# Altium project BMS_Carrier_Board.PrjPcb (part 3 of 3)

## Sheet BMS Carrier - Fan Controls.SchDoc: BMS Fan and Relay Control
size B; Author: Kevin Chen, Taiping Li; DocumentNumber: 4; SheetNumber: 4; SheetTotal: 4; Website: www.uwmidsun.com
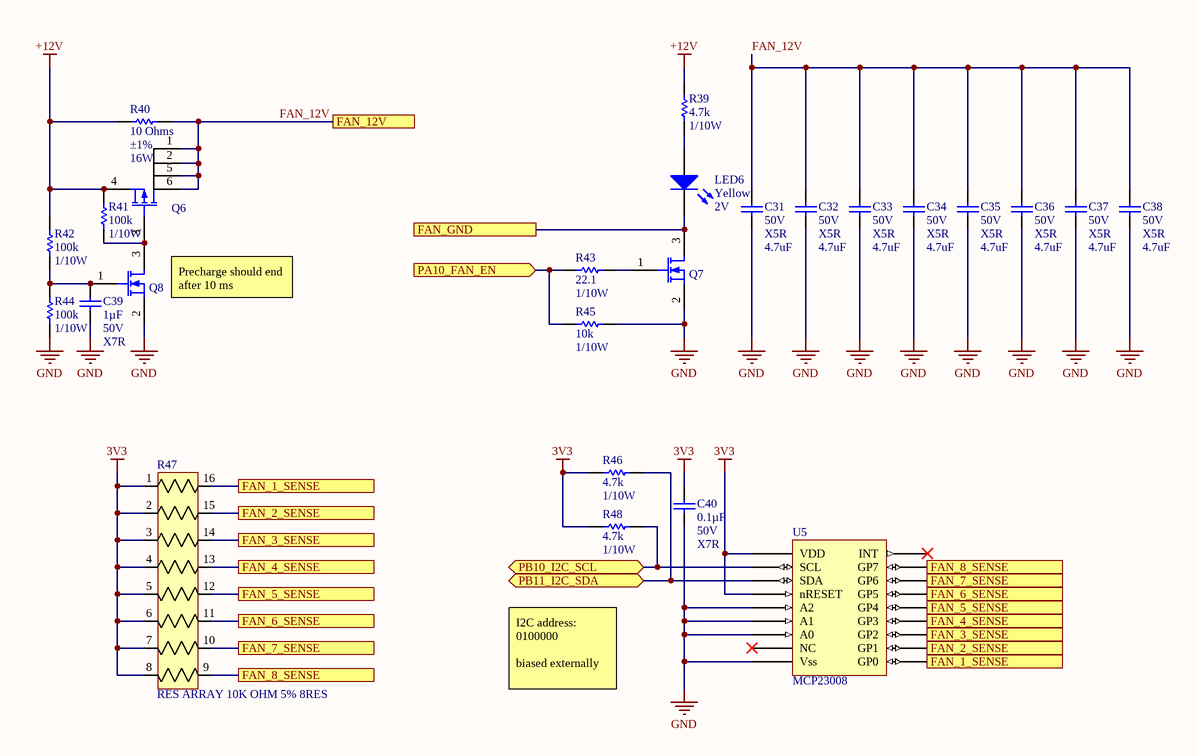
[diagram p6: BMS Carrier - Fan Controls.SchDoc]

### Parts
C31  value 4.7uF  Voltage - Rated: 50V  Temperature Coefficient: X5R  [CAP, 0805]  (hidden comment: CAP CER 4.7UF 50V 10% X5R 0805)
C32  value 4.7uF  Voltage - Rated: 50V  Temperature Coefficient: X5R  [CAP, 0805]  (hidden comment: CAP CER 4.7UF 50V 10% X5R 0805)
C33  value 4.7uF  Voltage - Rated: 50V  Temperature Coefficient: X5R  [CAP, 0805]  (hidden comment: CAP CER 4.7UF 50V 10% X5R 0805)
C34  value 4.7uF  Voltage - Rated: 50V  Temperature Coefficient: X5R  [CAP, 0805]  (hidden comment: CAP CER 4.7UF 50V 10% X5R 0805)
C35  value 4.7uF  Voltage - Rated: 50V  Temperature Coefficient: X5R  [CAP, 0805]  (hidden comment: CAP CER 4.7UF 50V 10% X5R 0805)
C36  value 4.7uF  Voltage - Rated: 50V  Temperature Coefficient: X5R  [CAP, 0805]  (hidden comment: CAP CER 4.7UF 50V 10% X5R 0805)
C37  value 4.7uF  Voltage - Rated: 50V  Temperature Coefficient: X5R  [CAP, 0805]  (hidden comment: CAP CER 4.7UF 50V 10% X5R 0805)
C38  value 4.7uF  Voltage - Rated: 50V  Temperature Coefficient: X5R  [CAP, 0805]  (hidden comment: CAP CER 4.7UF 50V 10% X5R 0805)
C39  Capacitance: 1µF  Voltage: 50V  Temperature Coefficient: X7R  [CAP, 0603]  (hidden comment: CAP CER 1UF 50V 10% X7R 0603)
C40  Capacitance: 0.1µF  Voltage: 50V  Temperature Coefficient: X7R  [CAP, 0603]  (hidden comment: CAP CER 0.1UF 50V 10% X7R 0603)
LED6  Color: Yellow  Voltage - Forward (Vf) (Typ): 2V  [LED_0603]  (hidden comment: LED YELLOW CLEAR 2.1V 0603)
Q6  MOSFET P-CH 30V 4A 1.6W SOT-23-6  [P-MOSFET]  (value not drawn)
Q7  MOSFET N-CH 30V 6.2A 0.9W SOT-23  [MOSFET N-CH 30V 6.2A 0.9W SOT-23]  (value not drawn)
Q8  MOSFET N-CH 30V 6.2A 0.9W SOT-23  [MOSFET N-CH 30V 6.2A 0.9W SOT-23]  (value not drawn)
R39  Resistance (Ohms): 4.7k  Power (Watts): 1/10W  [RES, 0603]  (hidden comment: RES 4.7K OHM 1% 1/10W 0603)
R40  Resistance: 10 Ohms  Tolerance: ±1%  Power: 16W  [RES2512]  (hidden comment: RES 10 OHM 1% 16W 2512)
R41  Resistance: 100k  Power: 1/10W  [RES, 0603]  (hidden comment: RES 100K OHM 5% 1/8W 0603)
R42  Resistance: 100k  Power: 1/10W  [RES, 0603]  (hidden comment: RES 100K OHM 5% 1/8W 0603)
R43  Resistance: 22.1  Power: 1/10W  [RES, 0603]  (hidden comment: RES 22.1 OHM 1% 1/10W 0603)
R44  Resistance: 100k  Power: 1/10W  [RES, 0603]  (hidden comment: RES 100K OHM 5% 1/8W 0603)
R45  Resistance: 10k  Power: 1/10W  [RES, 0603]  (hidden comment: RES 10K OHM 1% 1/10W 0603)
R46  Resistance (Ohms): 4.7k  Power (Watts): 1/10W  [RES, 0603]  (hidden comment: RES 4.7K OHM 1% 1/10W 0603)
R47  RES ARRAY 10K OHM 5% 8RES  [RES ARRAY, 8 POS 1506]
R48  Resistance (Ohms): 4.7k  Power (Watts): 1/10W  [RES, 0603]  (hidden comment: RES 4.7K OHM 1% 1/10W 0603)
U5  MCP23008  [IC 18SOIC]

### Ports
FAN_1_SENSE, FAN_1_SENSE (in), FAN_2_SENSE, FAN_2_SENSE (in), FAN_3_SENSE, FAN_3_SENSE (in), FAN_4_SENSE, FAN_4_SENSE (in), FAN_5_SENSE, FAN_5_SENSE (in), FAN_6_SENSE, FAN_6_SENSE (in), FAN_7_SENSE, FAN_7_SENSE (in), FAN_8_SENSE, FAN_8_SENSE (in), FAN_12V, FAN_GND, PA10_FAN_EN (in), PB10_I2C_SCL (bidir), PB11_I2C_SDA (bidir)

### Nets
3V3: C40.1 R46.1 R47.1 R47.2 R47.3 R47.4 R47.5 R47.6 R47.7 R47.8 R48.1 U5.6(nRESET) U5.18(VDD)
+12V: Q6.4(S) R39.1 R40.1 R41.2 R42.1
GND: C31.2 C32.2 C33.2 C34.2 C35.2 C36.2 C37.2 C38.2 C39.2 C40.2 Q7.2(S) Q8.2(S) R44.2 R45.2 U5.3(A2) U5.4(A1) U5.5(A0) U5.9(Vss)
FAN_12V: C31.1 C32.1 C33.1 C34.1 C35.1 C36.1 C37.1 C38.1 Q6.1(D) Q6.2(D) Q6.5(D) Q6.6(D) R40.2 ; port FAN_12V
PA10_FAN_EN: R43.2 R45.1 ; port PA10_FAN_EN
PB10/USART3_TX/I2C2_SCL: R48.2 U5.1(SCL) ; port PB10_I2C_SCL
PB11/USART3_RX/I2C2_SDA: R46.2 U5.2(SDA) ; port PB11_I2C_SDA
NetC7_1: R47.15 U5.11(GP1) ; port FAN_2_SENSE
NetC8_1: R47.16 U5.10(GP0) ; port FAN_1_SENSE
NetC9_1: R47.11 U5.15(GP5) ; port FAN_6_SENSE
NetC10_1: R47.12 U5.14(GP4) ; port FAN_5_SENSE
NetC14_1: R47.13 U5.13(GP3) ; port FAN_4_SENSE
NetC15_1: R47.14 U5.12(GP2) ; port FAN_3_SENSE
NetC16_1: R47.9 U5.17(GP7) ; port FAN_8_SENSE
NetC17_1: R47.10 U5.16(GP6) ; port FAN_7_SENSE
NetC39_1: C39.1 Q8.1(G) R42.2 R44.1
NetLED6_1: LED6.1(A) R39.2
NetLED6_2: LED6.2(K) Q7.3(D) ; port FAN_GND
NetQ6_3: Q6.3(G) Q8.3(D) R41.1
NetQ7_1: Q7.1(G) R43.1

Not connected (* = marked no-connect by the designer): U5 7(NC)* 8(INT)*

### Notes on the sheet
- Precharge should end after 10 ms
- I2C address: 0100000
  biased externally
- PROJECT
- DOCUMENT
- DRAWN BY
- LAST MODIFIED
- PART NUMBER
- REVISION
- SHEET
- VARIANT
- OF
- Engineering 5 - 1002
  University of Waterloo
  (519) 888-4567 x32978
  hardware@uwmidsun.com

### Library data of the parts
C31-C38 = CAP CER 4.7UF 50V 10% X5R 0805: 4.7µF ±20% 50V Ceramic Capacitor X5R 0805 (2012 Metric); Manufacturer 1: Murata Electronics North America; Manufacturer Part Number 1: GRT21BR61H475ME13L; Description 1: CAP CER 4.7UF 50V X5R 0805; Supplier 1: Digi-Key; Supplier Part Number 1: 490-12395-1-ND; RoHS: RoHS Compliant; Category: Capacitors; Stock 1: 4286; Pricing 1: 1=0.56, 10=0.389, 100=0.2338, 500=0.17536, 1000=0.14808 (CAD); Packaging: Cut Tape (CT); Part Status: Active; Tolerance: ±20%; Operating Temperature: -55°C ~ 85°C; Features: -; Ratings: AEC-Q200; Applications: Automotive; Mounting Type: Surface Mount, MLCC; Package / Case: 0805 (2012 Metric); Size / Dimension: 0.079" L x 0.049" W (2.00mm x 1.25mm); Height - Seated (Max): -; Thickness (Max): 0.057" (1.45mm); Lead Spacing: -; Lead Style: -; ComponentLink1URL: http://search.murata.co.jp/Ceramy/image/img/A01X/G101/ENG/GRT21BR61H475ME13-01.pdf; ComponentLink1Description: http://search.murata.co.jp/Ceramy/image/img/A01X/G101/ENG/GRT21BR61H475ME13-01.pdf
C39 = CAP CER 1UF 50V 10% X7R 0603: 1µF ±10% 50V Ceramic Capacitor X7R 0603 (1608 Metric); Manufacturer 1: Taiyo Yuden; Manufacturer Part Number 1: UMK107AB7105KA-T; Supplier 1: Digi-Key; Supplier Part Number 1: 587-3247-1-ND; Packaging: Cut Tape (CT); Part Status: Active; Operating Temperature: -55°C ~ 125°C; Ratings: -; Mounting Type: Surface Mount, MLCC; Package / Case: 0603 (1608 Metric); Size / Dimension: 0.063" L x 0.031" W (1.60mm x 0.80mm); Height - Seated (Max): -; Thickness (Max): 0.037" (0.95mm); Lead Spacing: -; Lead Style: -; ComponentLink1URL: http://www.yuden.co.jp/productdata/catalog/en/mlcc_all_e.pdf; ComponentLink1Description: http://www.yuden.co.jp/productdata/catalog/en/mlcc_all_e.pdf; Tolerance: ±10%
C40 = CAP CER 0.1UF 50V 10% X7R 0603: 0.10µF ±10% 50V Ceramic Capacitor X7R 0603 (1608 Metric); Manufacturer 1: AVX Corporation; Manufacturer Part Number 1: 06035C104KAT2A; Supplier 1: Digi-Key; Supplier Part Number 1: 478-5052-1-ND; Packaging: Cut Tape (CT); Part Status: Active; Operating Temperature: -55°C ~ 125°C; Ratings: -; Mounting Type: Surface Mount, MLCC; Package / Case: 0603 (1608 Metric); Size / Dimension: 0.063" L x 0.032" W (1.60mm x 0.81mm); Height - Seated (Max): -; Thickness (Max): 0.035" (0.90mm); Lead Spacing: -; Lead Style: -; ComponentLink1URL: http://datasheets.avx.com/X7RDielectric.pdf; ComponentLink1Description: http://datasheets.avx.com/X7RDielectric.pdf; Tolerance: ±10%
LED6 = LED YELLOW CLEAR 2.1V 0603: Yellow 590nm LED Indication - Discrete 2V 0603 (1608 Metric); Manufacturer: Wurth Electronics Inc.; Manufacturer Part Number: 150060YS75000; Lens Color: Colorless; Millicandela Rating: 120mcd; Lens Style/Size: Rectangle with Flat Top, 1.10mm x 0.70mm; Current - Test: 20mA; Viewing Angle: 140°; Wavelength - Peak: 595nm; Supplier 1: Digi-Key; RoHS: RoHS Compliant; Category: Optoelectronics; Stock 1: 10523; Pricing 1: 1=0.21, 100=0.1617, 500=0.13964 (CAD); Packaging: Cut Tape (CT); Part Status: Active; Lens Transparency: Clear; Mounting Type: Surface Mount; Wavelength - Dominant: 590nm; Features: -; Package / Case: 0603 (1608 Metric); Supplier Device Package: 0603; Size / Dimension: 1.60mm L x 0.80mm W; Height (Max): 0.80mm; ComponentLink1URL: http://katalog.we-online.de/led/datasheet/150060YS75000.pdf; ComponentLink1Description: http://katalog.we-online.de/led/datasheet/150060YS75000.pdf; Supplier Part Number 1: 732-4981-1-ND
Q6 = MOSFET P-CH 30V 4A 1.6W SOT-23-6: P-Channel 30V 4A (Ta) 1.6W (Ta) Surface Mount SOT-23-6; Manufacturer 1: STMicroelectronics; Manufacturer Part Number 1: STT4P3LLH6; Current - Continuous Drain (Id) @ 25°C: 4A (Ta); Drive Voltage (Max Rds On,  Min Rds On): 4.5V, 10V; Vgs(th) (Max) @ Id: 2.5V @ 250µA; Gate Charge (Qg) (Max) @ Vgs: 6nC @ 4.5V; Input Capacitance (Ciss) (Max) @ Vds: 639pF @ 25V; Vgs (Max): ±20V; Rds On (Max) @ Id, Vgs: 56 mOhm @ 2A, 10V; Supplier 1: Digi-Key; Supplier Part Number 1: 497-15521-1-ND; Packaging: Cut Tape (CT); Part Status: Active; FET Type: P-Channel; Technology: MOSFET (Metal Oxide); Drain to Source Voltage (Vdss): 30V; FET Feature: -; Power Dissipation (Max): 1.6W (Ta); Operating Temperature: 150°C (TJ); Mounting Type: Surface Mount; Supplier Device Package: SOT-23-6; Package / Case: SOT-23-6; ComponentLink1URL: http://www.st.com/content/ccc/resource/technical/document/datasheet/13/e4/a1/65/8b/79/44/73/DM00084060.pdf/files/DM00084060.pdf/jcr:content/translations/en.DM00084060.pdf; ComponentLink1Description: http://www.st.com/content/ccc/resource/technical/document/datasheet/13/e4/a1/65/8b/79/44/73/DM00084060.pdf/files/DM00084060.pdf/jcr:content/translations/en.DM00084060.pdf
Q7 Q8 = MOSFET N-CH 30V 6.2A 0.9W SOT-23: N-Channel 30V 6.2A (Ta) 900mW (Ta) Surface Mount SOT-23; Manufacturer: Diodes; Manufacturer Part Number: DMN3023L-7; Rds On Max: 25mR; Input Capacitance: 873pF; Supplier 1: Digi-Key; Stock 1: 38246; Pricing 1: 1=0.47, 10=0.368, 100=0.2529, 500=0.1734, 1000=0.1301 (USD); Mount: Surface Mount; Case/Package: TO-236-3; Min Operating Temperature: -55°C; Max Operating Temperature: 150°C; Packaging: Tape and Reel; Drain to Source Voltage (Vdss): 30V; Continuous Drain Current (ID): 6.2A; Max Power Dissipation: 900mW; ComponentLink1URL: https://www.diodes.com/assets/Datasheets/DMN3023L.pdf; ComponentLink1Description: https://www.diodes.com/assets/Datasheets/DMN3023L.pdf; ComponentLink2URL: http://www.mouser.com/ds/2/115/DMN3023L-959533.pdf; ComponentLink2Description: http://www.mouser.com/ds/2/115/DMN3023L-959533.pdf; Supplier Part Number 1: DMN3023L-7DICT-ND
R39 R46 R48 = RES 4.7K OHM 1% 1/10W 0603: 4.7k Ohm ±1% 0.1W, 1/10W Chip Resistor 0603 (1608 Metric) Moisture Resistant Thick Film; Manufacturer 1: Yageo; Manufacturer Part Number 1: RC0603FR-074K7L; Description 1: RES SMD 4.7K OHM 1% 1/10W 0603; Temperature Coefficient: ±100ppm/°C; Supplier 1: Digi-Key; Supplier Part Number 1: 311-4.70KHRCT-ND; RoHS: RoHS Compliant; Category: Resistors; Stock 1: 3487566; Pricing 1: 1=0.16, 10=0.022, 100=0.0089, 1000=0.00402, 2500=0.00349 (CAD); Packaging: Cut Tape (CT); Part Status: Active; Composition: Thick Film; Features: Moisture Resistant; Operating Temperature: -55°C ~ 155°C; Package / Case: 0603 (1608 Metric); Supplier Device Package: 0603; Size / Dimension: 0.063" L x 0.031" W (1.60mm x 0.80mm); Height - Seated (Max): 0.022" (0.55mm); Failure Rate: -; ComponentLink1URL: http://www.yageo.com/documents/recent/PYu-RC_Group_51_RoHS_L_7.pdf; ComponentLink1Description: http://www.yageo.com/documents/recent/PYu-RC_Group_51_RoHS_L_7.pdf; Tolerance: ±1%
R40 = RES 10 OHM 1% 16W 2512: 10 Ohms ±1% 16W Chip Resistor 2512 (6432 Metric) Moisture Resistant Thin Film; Temperature Coefficient: ±50ppm/°C; Packaging: Cut Tape (CT); Part Status: Active; Composition: Thin Film; Operating Temperature: -55°C ~ 155°C; Package / Case: 2512 (6432 Metric); Supplier Device Package: 2512; Size / Dimension: 0.248" L x 0.126" W (6.30mm x 3.20mm); Height - Seated (Max): 0.031" (0.80mm); Failure Rate: -; ComponentLink1Description: Datasheet; ComponentLink1URL: https://www.susumu.co.jp/common/pdf/CPA.pdf; ComponentLink2Description: Application Note; ComponentLink2URL: https://media.digikey.com/pdf/Data%20Sheets/Susumu%20PDFs/CPA2512%20Series%20Appl%20Note.pdf; Supplier 1: Digi-Key; Supplier Part Number 1: CPA25Q10.0CT-ND
R41 R42 R44 = RES 100K OHM 5% 1/8W 0603: RES SMD 100K OHM 5% 1/10W 0603; Manufacturer 1: Yageo; Manufacturer Part Number 1: RC0603JR-07100KL; Temperature Coefficient: ±100ppm/°C; Supplier 1: Digi-Key; Supplier Part Number 1: 311-100KGRCT-ND; Packaging: Cut Tape (CT); Part Status: Active; Composition: Thick Film; Operating Temperature: -55°C ~ 155°C; Package / Case: 0603 (1608 Metric); Supplier Device Package: 0603; Size / Dimension: 0.063" L x 0.031" W (1.60mm x 0.80mm); Height - Seated (Max): 0.022" (0.55mm); Failure Rate: -; ComponentLink1URL: http://www.yageo.com/documents/recent/PYu-RC_Group_51_RoHS_L_7.pdf; ComponentLink1Description: http://www.yageo.com/documents/recent/PYu-RC_Group_51_RoHS_L_7.pdf; Tolerance: ±5%
R43 = RES 22.1 OHM 1% 1/10W 0603: 22.1 Ohm ±1% 0.1W, 1/10W Chip Resistor 0603 (1608 Metric) Moisture Resistant Thick Film; Manufacturer 1: Yageo; Manufacturer Part Number 1: RC0603FR-0722R1L; Temperature Coefficient: ±100ppm/°C; Supplier 1: Digi-Key; Supplier Part Number 1: 311-22.1HRCT-ND; Packaging: Cut Tape (CT); Part Status: Active; Composition: Thick Film; Operating Temperature: -55°C ~ 155°C; Package / Case: 0603 (1608 Metric); Supplier Device Package: 0603; Size / Dimension: 0.063" L x 0.031" W (1.60mm x 0.80mm); Height - Seated (Max): 0.022" (0.55mm); Failure Rate: -; ComponentLink1URL: http://www.yageo.com/documents/recent/PYu-RC_Group_51_RoHS_L_7.pdf; ComponentLink1Description: http://www.yageo.com/documents/recent/PYu-RC_Group_51_RoHS_L_7.pdf; Tolerance: ±1%
R45 = RES 10K OHM 1% 1/10W 0603: RES SMD 10K OHM 1% 1/10W 0603; Manufacturer 1: Yageo; Manufacturer Part Number 1: RC0603FR-0710KL; Temperature Coefficient: ±100ppm/°C; Supplier 1: Digi-Key; Supplier Part Number 1: 311-10.0KHRCT-ND; Packaging: Cut Tape (CT); Part Status: Active; Composition: Thick Film; Operating Temperature: -55°C ~ 155°C; Package / Case: 0603 (1608 Metric); Supplier Device Package: 0603; Size / Dimension: 0.063" L x 0.031" W (1.60mm x 0.80mm); Height - Seated (Max): 0.022" (0.55mm); Failure Rate: -; ComponentLink1URL: http://www.yageo.com/documents/recent/PYu-RC_Group_51_RoHS_L_7.pdf; ComponentLink1Description: http://www.yageo.com/documents/recent/PYu-RC_Group_51_RoHS_L_7.pdf; Tolerance: ±1%
R47 = RES ARRAY 10K OHM 5% 8RES EXB-2HV103JV: RES ARRAY SMD 10K 5% 62.5mW 1506; Manufacturer: Panasonic Electronic Components; Vendor: Panasonic; C: Copyright (C) 2015 Accelerated Designs. All rights reserved; Circuit Type: Isolated; Temperature Coefficient: ±200ppm/°C; Value: Value; Copyright: Copyright (C) 2015 Accelerated Designs. All rights reserved; Manufacturer_Part_Number: EXB-2HV103JV; Supplier 1: Digi-Key; Manufacturer Part Number: EXB-2HV103JV; RoHS: RoHS Compliant; Category: Resistors; Stock 1: 152779; Pricing 1: 1=0.43, 10=0.373, 25=0.2712, 50=0.1964, 100=0.1456, 250=0.11176, 500=0.08806, 1000=0.06096 (CAD); Packaging: Cut Tape (CT); Part Status: Active; Resistance (Ohms): 10k; Tolerance: ±5%; Power Per Element: 62.5mW; Operating Temperature: -55°C ~ 125°C; Applications: Automotive AEC-Q200; Mounting Type: Surface Mount; Package / Case: 1506, Convex, Long Side Terminals; Supplier Device Package: 1506; Size / Dimension: 0.150" L x 0.063" W (3.80mm x 1.60mm); Height - Seated (Max): 0.022" (0.55mm); ComponentLink1URL: https://industrial.panasonic.com/cdbs/www-data/pdf/AOC0000/AOC0000C14.pdf; ComponentLink1Description: https://industrial.panasonic.com/cdbs/www-data/pdf/AOC0000/AOC0000C14.pdf; Supplier Part Number 1: Y1103CT-ND
U5 = IC I/O EXPANDER I2C 8B 18SOIC: MCP23008 I/O Expander 8B+1Int 18P SOIC; Manufacturer: Microchip Technology; Manufacturer Part Number: MCP23008T-E/SO; Number of I/O: 8; Interface: I²C; Interrupt Output: Yes; Output Type: Push-Pull; Current - Output Source/Sink: 25mA; Voltage - Supply: 1.8 V ~ 5.5 V; Supplier 1: Digi-Key; Supplier Part Number 1: MCP23008T-E/SOCT-ND; RoHS: RoHS Compliant; Category: Integrated Circuits (ICs); Stock 1: 5607; Pricing 1: 1=1.62, 25=1.3548, 100=1.2431 (CAD); Packaging: Cut Tape (CT); Part Status: Active; Features: POR; Operating Temperature: -40°C ~ 125°C; Mounting Type: Surface Mount; Package / Case: 18-SOIC (0.295", 7.50mm Width); Supplier Device Package: 18-SOIC; ComponentLink1URL: http://www.microchip.com/mymicrochip/filehandler.aspx?ddocname=en021920; ComponentLink1Description: http://www.microchip.com/mymicrochip/filehandler.aspx?ddocname=en021920

## Nets that join several sheets
3V3: Controller_Board_Interface (6 pins), BMS Carrier - Connectors (6 pins), BMS Carrier - AFE Interface (8 pins), BMS Carrier - Current Sense Interface (8 pins), BMS Carrier - Battery Relay Controls (R22.4), BMS Carrier - Firmware Contactor Control (C43.1 U6.3 U6.6 U6.18), BMS Carrier - Fan Controls (13 pins)
5V: Controller_Board_Interface (7 pins), BMS Carrier - Connectors (R5.1)
+12V: Controller_Board_Interface (7 pins), BMS Carrier - Connectors (P3.4 P5.1 P5.2 R6.1), BMS Carrier - Battery Relay Controls (K1.3 U4.13 U4.14), BMS Carrier - Fan Controls (5 pins)
GND: Controller_Board_Interface (24 pins), BMS Carrier - Connectors (16 pins), BMS Carrier - AFE Interface (7 pins), BMS Carrier - Current Sense Interface (9 pins), BMS Carrier - Battery Relay Controls (24 pins), BMS Carrier - Firmware Contactor Control (13 pins), BMS Carrier - Fan Controls (18 pins)
12V_KILL_SW_to_Relay: BMS Carrier - Connectors (P6.2), BMS Carrier - Battery Relay Controls (D8.2 K1.1 R32.1)
CURR_ISOSPI_N: BMS Carrier - Connectors (P3.1), BMS Carrier - Current Sense Interface (XFMR1.14)
CURR_ISOSPI_P: BMS Carrier - Connectors (P3.2), BMS Carrier - Current Sense Interface (XFMR1.16)
FAN_12V: BMS Carrier - Connectors (8 pins), BMS Carrier - Fan Controls (13 pins)
HV_RELAY_COIL_12V: BMS Carrier - Connectors (P9.7 P9.10 P9.11), BMS Carrier - Battery Relay Controls (16 pins)
ISOSPI_N: BMS Carrier - Connectors (P4.1), BMS Carrier - AFE Interface (XFMR1.9)
ISOSPI_P: BMS Carrier - Connectors (P4.2), BMS Carrier - AFE Interface (XFMR1.11)
NetC7_1: BMS Carrier - Connectors (C7.1 P7.4), BMS Carrier - Fan Controls (R47.15 U5.11)
NetC8_1: BMS Carrier - Connectors (C8.1 P7.2), BMS Carrier - Fan Controls (R47.16 U5.10)
NetC9_1: BMS Carrier - Connectors (C9.1 P8.4), BMS Carrier - Fan Controls (R47.11 U5.15)
NetC10_1: BMS Carrier - Connectors (C10.1 P8.2), BMS Carrier - Fan Controls (R47.12 U5.14)
NetC14_1: BMS Carrier - Connectors (C14.1 P10.4), BMS Carrier - Fan Controls (R47.13 U5.13)
NetC15_1: BMS Carrier - Connectors (C15.1 P10.2), BMS Carrier - Fan Controls (R47.14 U5.12)
NetC16_1: BMS Carrier - Connectors (C16.1 P11.4), BMS Carrier - Fan Controls (R47.9 U5.17)
NetC17_1: BMS Carrier - Connectors (C17.1 P11.2), BMS Carrier - Fan Controls (R47.10 U5.16)
NetC42_1: BMS Carrier - Connectors (P9.4), BMS Carrier - Firmware Contactor Control (C42.1 R49.2 R50.1)
NetC45_1: BMS Carrier - Connectors (P9.2), BMS Carrier - Firmware Contactor Control (C45.1 R51.2 R52.1)
NetC47_1: BMS Carrier - Connectors (P9.6), BMS Carrier - Firmware Contactor Control (C47.1 R53.2 R54.1)
NetD2_2: BMS Carrier - Connectors (P9.8), BMS Carrier - Battery Relay Controls (D2.2 LED3.2 Q1.3)
NetD5_2: BMS Carrier - Connectors (P9.9), BMS Carrier - Battery Relay Controls (D5.2 LED4.2 Q2.3)
NetD7_2: BMS Carrier - Connectors (P9.12), BMS Carrier - Battery Relay Controls (D7.2 LED5.2 Q5.3)
NetLED6_2: BMS Carrier - Connectors (8 pins), BMS Carrier - Fan Controls (LED6.2 Q7.3)
NetP6_1: BMS Carrier - Connectors (P6.1), BMS Carrier - Battery Relay Controls (U4.11 U4.12)
NetP7_6: Controller_Board_Interface (R4.1), BMS Carrier - Connectors (8 pins)
NetR22_3: BMS Carrier - Battery Relay Controls (R22.3), BMS Carrier - Firmware Contactor Control (U6.10)
NetR22_5: BMS Carrier - Battery Relay Controls (R22.5), BMS Carrier - Firmware Contactor Control (U6.11)
NetR22_6: BMS Carrier - Battery Relay Controls (R22.6), BMS Carrier - Firmware Contactor Control (U6.12)
PA4/SPI1_NSS: Controller_Board_Interface (P2.21), BMS Carrier - AFE Interface (P12.4 U2.5)
PA5/SPI1_SCK: Controller_Board_Interface (P2.20), BMS Carrier - AFE Interface (P12.3 U2.4)
PA6/SPI1_MISO: Controller_Board_Interface (P2.19), BMS Carrier - AFE Interface (P12.2 R7.2 U2.3)
PA7/SPI1_MOSI: Controller_Board_Interface (P2.18), BMS Carrier - AFE Interface (P12.1 U2.2)
PA10_FAN_EN: Controller_Board_Interface (P2.5), BMS Carrier - Fan Controls (R43.2 R45.1)
PB1_HSD_CS: Controller_Board_Interface (P2.16), BMS Carrier - Battery Relay Controls (C26.1 D4.1 R22.7)
PB5_KILL_SWITCH_MONITOR: Controller_Board_Interface (P2.36), BMS Carrier - Battery Relay Controls (R32.2 R36.1)
PB6_HV_GND_RELAY_EN: Controller_Board_Interface (P2.34), BMS Carrier - Battery Relay Controls (R28.1 R29.1)
PB7_HV_PWR_RELAY_EN: Controller_Board_Interface (P2.33), BMS Carrier - Battery Relay Controls (R23.1 R24.1)
PB8_HV_CHRG_RELAY_EN: Controller_Board_Interface (P2.32), BMS Carrier - Battery Relay Controls (R35.1 R38.1)
PB9_KILL_SWITCH_EN: Controller_Board_Interface (P2.31), BMS Carrier - Battery Relay Controls (R22.2)
PB10/USART3_TX/I2C2_SCL: Controller_Board_Interface (P2.14), BMS Carrier - Firmware Contactor Control (U6.1), BMS Carrier - Fan Controls (R48.2 U5.1)
PB11/USART3_RX/I2C2_SDA: Controller_Board_Interface (P2.13), BMS Carrier - Firmware Contactor Control (U6.2), BMS Carrier - Fan Controls (R46.2 U5.2)
PB12/SPI2_NSS: Controller_Board_Interface (P2.11), BMS Carrier - Current Sense Interface (P13.4 U3.5)
PB13/SPI2_SCK: Controller_Board_Interface (P2.10), BMS Carrier - Current Sense Interface (P13.3 U3.4)
PB14/SPI2_MISO: Controller_Board_Interface (P2.9), BMS Carrier - Current Sense Interface (P13.2 R12.2 U3.3)
PB15/SPI2_MOSI: Controller_Board_Interface (P2.8), BMS Carrier - Current Sense Interface (P13.1 U3.2)

## Assembly variants
BMS_Carrier_Board: not fitted P13 P14 R13 R19